# Altium schematic sheet Sensor.SchDoc
size A; SheetNumber: 4; SheetTotal: 6
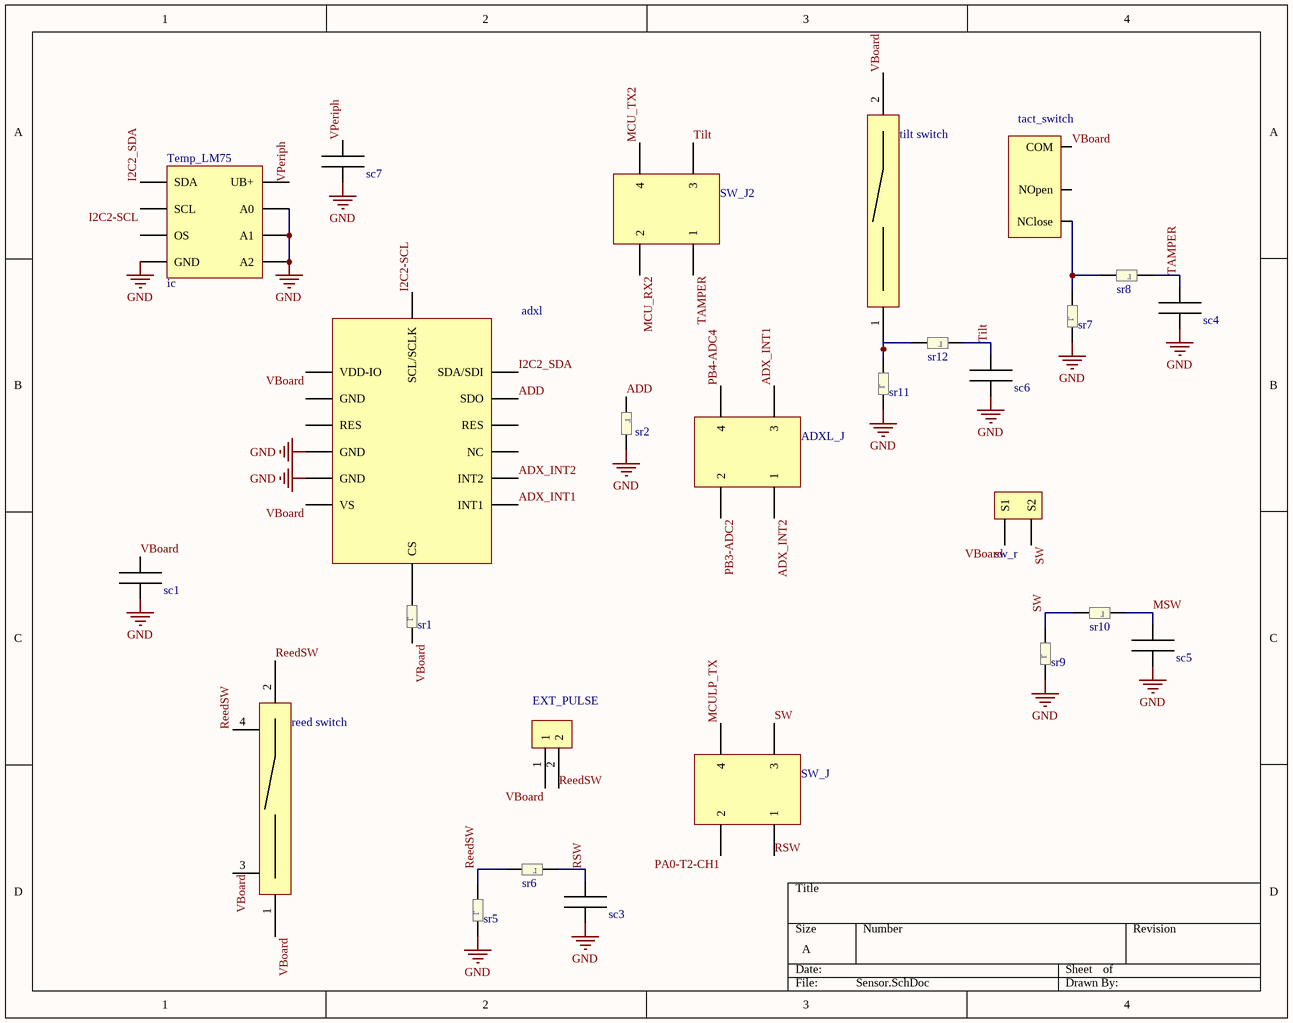
[diagram p0: Sensor.SchDoc]

## Parts
adxl  ic  [abr_ic_adxl345_3d]  (value not drawn)
ADXL_J  pin header 2mm  [abr_ph_2x2_2mm_3d_male]  (value not drawn)
EXT_PULSE  YB2 SMD  [abr_sw_yb_2p_3d]  (value not drawn)
reed_switch  switch  [abr_reed_sw_3d]  (value not drawn)
sc1  100nf  [abr_cap_0805_3d]  (value not drawn)
sc3  100nf  [abr_cap_0805_3d]  (value not drawn)
sc4  100nf  [abr_cap_0805_3d]  (value not drawn)
sc5  100nf  [abr_cap_0805_3d]  (value not drawn)
sc6  100nf  [abr_cap_0805_3d]  (value not drawn)
sc7  100nf  [abr_cap_0805_3d]  (value not drawn)
sr1  100k  [abr_res_0805_3d]  (value not drawn)
sr2  100k  [abr_res_0805_3d]  (value not drawn)
sr5  2.2K  [abr_res_0805_3d]  (value not drawn)
sr6  1k  [abr_res_0805_3d]  (value not drawn)
sr7  2.2K  [abr_res_0805_3d]  (value not drawn)
sr8  1k  [abr_res_0805_3d]  (value not drawn)
sr9  2.2K  [abr_res_0805_3d]  (value not drawn)
sr10  1k  [abr_res_0805_3d]  (value not drawn)
sr11  2.2K  [abr_res_0805_3d]  (value not drawn)
sr12  1k  [abr_res_0805_3d]  (value not drawn)
SW_J  pin header 2mm  [abr_ph_2x2_2mm_3d_male]  (value not drawn)
SW_J2  pin header 2mm  [abr_ph_2x2_2mm_3d_male]  (value not drawn)
sw_r  switch  [abr_sw_tact_3d]  (value not drawn)
tact_switch  switch  [abr_proximity_switch_3d]  (value not drawn)
Temp_LM75  ic  [abr_ic_lm75_3d]
tilt_switch  switch  [abr_tilt_horiz_sw200d_3d]  (value not drawn)

## Nets
GND: adxl.4(GND) adxl.5(GND) sc1.0 sc3.0 sc4.0 sc5.0 sc6.0 sc7.1 sr2.1 sr5.0 sr7.0 sr9.0 sr11.0 Temp_LM75.4(GND) Temp_LM75.5(A2) Temp_LM75.6(A1) Temp_LM75.7(A0)
ADD: adxl.12(SDO) sr2.0
ADX_INT1: adxl.8(INT1) ADXL_J.3
ADX_INT2: adxl.9(INT2) ADXL_J.1
I2C2-SCL: adxl.14(SCL/SCLK) Temp_LM75.2(SCL)
I2C2_SDA: adxl.13(SDA/SDI) Temp_LM75.1(SDA)
MCU_RX2: SW_J2.2
MCU_TX2: SW_J2.4
MCULP_TX: SW_J.4
MSW: sc5.1 sr10.0
PA0-T2-CH1: SW_J.2
PB3-ADC2: ADXL_J.2
PB4-ADC4: ADXL_J.4
ReedSW: EXT_PULSE.2 reed_switch.2 reed_switch.4 sr5.1 sr6.1
RSW: sc3.1 sr6.0 SW_J.1
SW: sr9.1 sr10.1 SW_J.3 sw_r.2(S2)
TAMPER: sc4.1 sr8.0 SW_J2.1
Tilt: sc6.1 sr12.0 SW_J2.3
VBoard: adxl.1(VDD-IO) adxl.6(VS) EXT_PULSE.1 reed_switch.1 reed_switch.3 sc1.1 sr1.0 sw_r.1(S1) tact_switch.1(COM) tilt_switch.2
VPeriph: sc7.0 Temp_LM75.8(UB+)
Netadxl_7: adxl.7(CS) sr1.1
Netsr7_1: sr7.1 sr8.1 tact_switch.3(NClose)
Netsr11_1: sr11.1 sr12.1 tilt_switch.1

Not connected (* = marked no-connect by the designer): adxl 2(GND) 3(RES) 10(NC) 11(RES); tact_switch 2(NOpen); Temp_LM75 3(OS)

## Notes on the sheet
- (in symbol abr_res_0805) r

## Library data of the parts
adxl = abr_ic_adxl345
ADXL_J SW_J SW_J2 = abr_2x2_2mm
reed_switch = abr_reed_sw
sc1 sc3-sc7 = abr_cap_0805
sr1 sr2 sr5-sr12 = abr_res_0805
sw_r = abr_switch_tact
tact_switch = abr_tact_switch
Temp_LM75 = abr_ic_lm75
tilt_switch = abr_tilt_sw